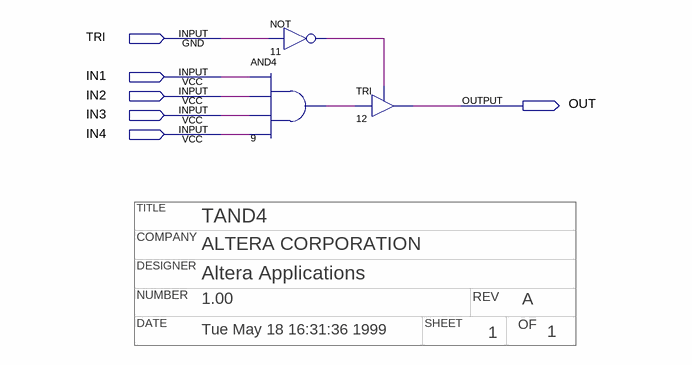
[diagram p0: schematic sheet]
// Quartus schematic tand4.bdf as structural Verilog: 3 symbols, 6 pins
// Title block: TITLE: TAND4; COMPANY: ALTERA CORPORATION; DESIGNER: Altera Applications; NUMBER: 1.00; REV: A; DATE: Tue May 18 16:31:36 1999; SHEET: 1; OF: 1
module tand4 (
  input  TRI,
  input  IN1,
  input  IN2,
  input  IN3,
  input  IN4,
  output OUT
);

  wire n9_out, n11_out;

  not u_11 (n11_out, TRI);
  and u_9 (n9_out, IN1, IN2, IN3, IN4);
  TRI u_12 (.IN(n9_out), .OE(n11_out), .OUT(OUT));
endmodule
